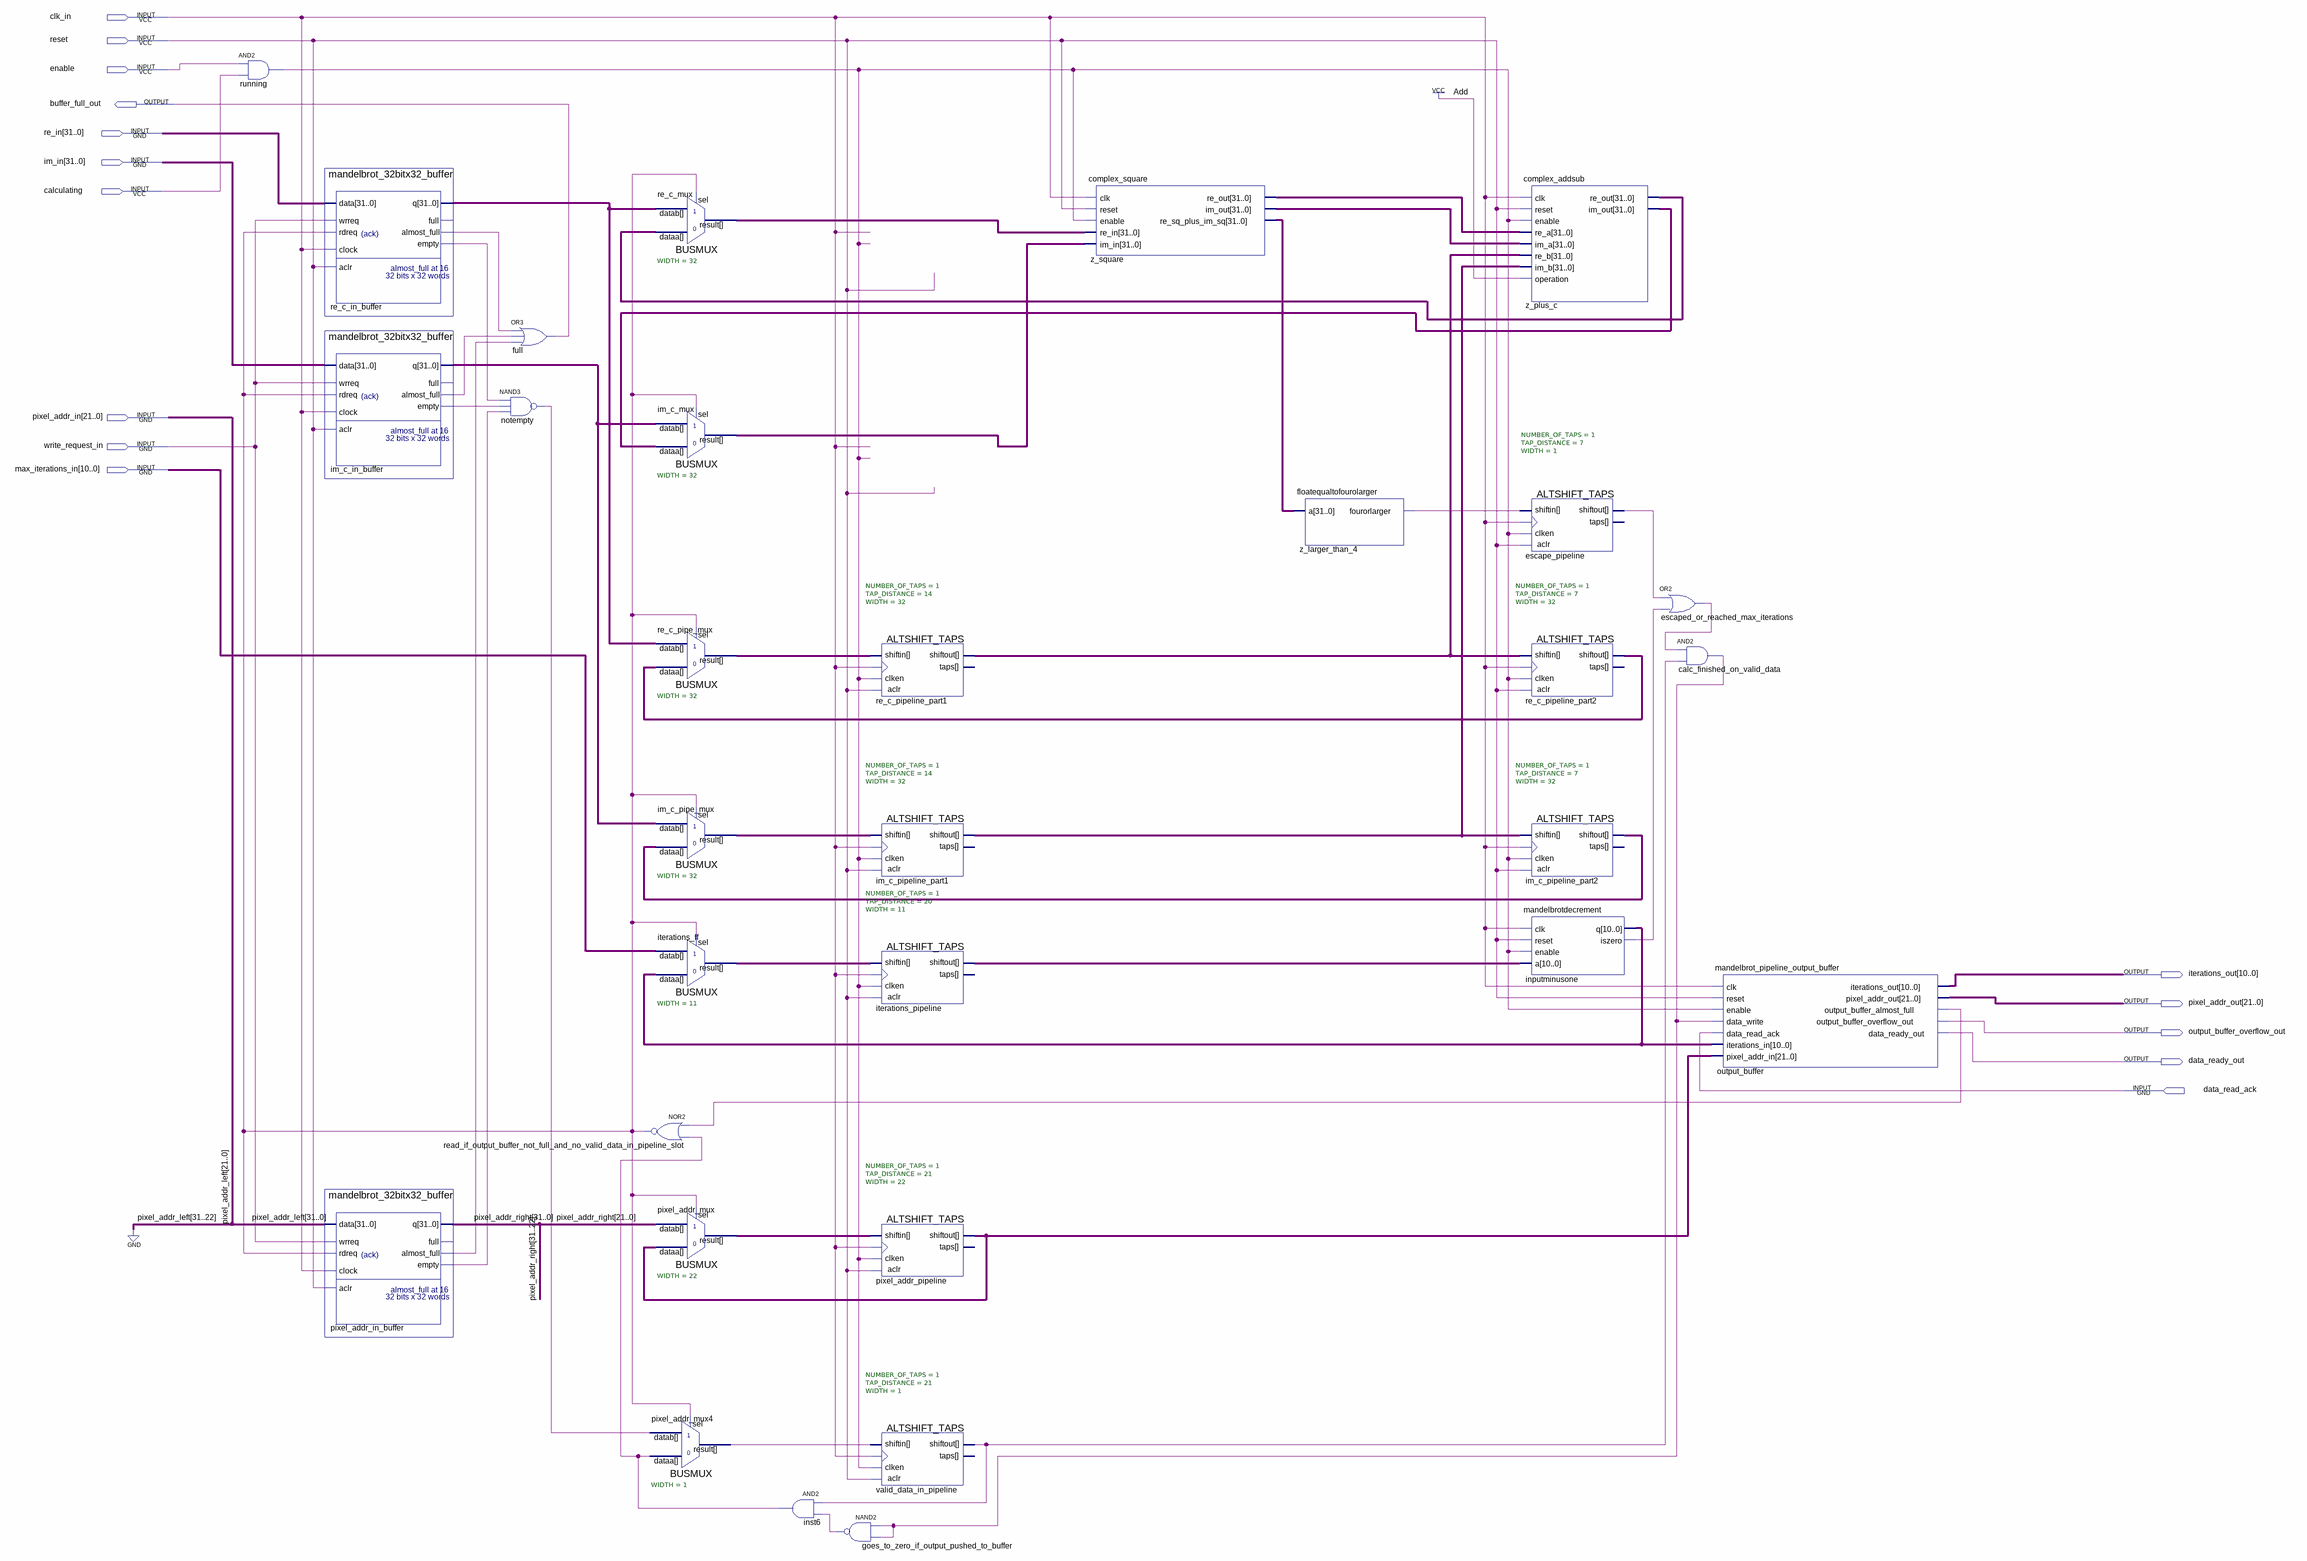
[diagram p0: schematic sheet]
// Quartus schematic mandelbrotpipeline.bdf as structural Verilog: 31 symbols, 15 pins
module mandelbrotpipeline (
  input  clk_in,
  input  reset,
  input  enable,
  input  [31:0] re_in,
  input  [31:0] im_in,
  input  calculating,
  input  [21:0] pixel_addr_in,
  input  write_request_in,
  input  [10:0] max_iterations_in,
  input  data_read_ack,
  output buffer_full_out,
  output [10:0] iterations_out,
  output [21:0] pixel_addr_out,
  output output_buffer_overflow_out,
  output data_ready_out
);

  wire calc_finished_on_valid_data_out, escape_pipeline_shiftout, escaped_or_reached_max_iterations_out,
       goes_to_zero_if_output_pushed_to_buffer_out, im_c_in_buffer_almost_full, im_c_in_buffer_empty,
       inputminusone_iszero, inst6_out, notempty_out, output_buffer_output_buffer_almost_full,
       pixel_addr_in_buffer_almost_full, pixel_addr_in_buffer_empty, pixel_addr_mux4_result,
       re_c_in_buffer_almost_full, re_c_in_buffer_empty,
       read_if_output_buffer_not_full_and_no_valid_data_in_pipeline_slot_out, running_out,
       valid_data_in_pipeline_shiftout, z_larger_than_4_fourorlarger;
  wire [10:0] inputminusone_q, iterations_ff_result, iterations_pipeline_shiftout;
  wire [21:0] pixel_addr_mux_result, pixel_addr_pipeline_shiftout;
  wire [31:0] im_c_in_buffer_q, im_c_mux_result, im_c_pipe_mux_result, im_c_pipeline_part1_shiftout,
       im_c_pipeline_part2_shiftout, pixel_addr_right, re_c_in_buffer_q, re_c_mux_result,
       re_c_pipe_mux_result, re_c_pipeline_part1_shiftout, re_c_pipeline_part2_shiftout, z_plus_c_im_out,
       z_plus_c_re_out, z_square_im_out, z_square_re_out, z_square_re_sq_plus_im_sq;

  and running (running_out, enable, calculating);
  mandelbrot_32bitx32_buffer re_c_in_buffer (
    .data(re_in), .wrreq(write_request_in),
    .rdreq(read_if_output_buffer_not_full_and_no_valid_data_in_pipeline_slot_out), .clock(clk_in),
    .aclr(reset), .q(re_c_in_buffer_q), .almost_full(re_c_in_buffer_almost_full), .empty(re_c_in_buffer_empty));  // open: full
  mandelbrot_32bitx32_buffer im_c_in_buffer (
    .data(im_in), .wrreq(write_request_in),
    .rdreq(read_if_output_buffer_not_full_and_no_valid_data_in_pipeline_slot_out), .clock(clk_in),
    .aclr(reset), .q(im_c_in_buffer_q), .almost_full(im_c_in_buffer_almost_full), .empty(im_c_in_buffer_empty));  // open: full
  mandelbrot_32bitx32_buffer pixel_addr_in_buffer (
    .data({{10{1'b0}}, pixel_addr_in}), .wrreq(write_request_in),
    .rdreq(read_if_output_buffer_not_full_and_no_valid_data_in_pipeline_slot_out), .clock(clk_in),
    .aclr(reset), .q(pixel_addr_right), .almost_full(pixel_addr_in_buffer_almost_full),
    .empty(pixel_addr_in_buffer_empty));  // open: full
  nand notempty (notempty_out, re_c_in_buffer_empty, im_c_in_buffer_empty, pixel_addr_in_buffer_empty);
  or full (buffer_full_out, re_c_in_buffer_almost_full, im_c_in_buffer_almost_full, pixel_addr_in_buffer_almost_full);
  BUSMUX #(.WIDTH(32)) re_c_mux (
    .datab(re_c_in_buffer_q), .sel(read_if_output_buffer_not_full_and_no_valid_data_in_pipeline_slot_out),
    .dataa(z_plus_c_re_out), .result(re_c_mux_result));
  BUSMUX #(.WIDTH(32)) im_c_mux (
    .datab(im_c_in_buffer_q), .sel(read_if_output_buffer_not_full_and_no_valid_data_in_pipeline_slot_out),
    .dataa(z_plus_c_im_out), .result(im_c_mux_result));
  BUSMUX #(.WIDTH(32)) re_c_pipe_mux (
    .datab(re_c_in_buffer_q), .sel(read_if_output_buffer_not_full_and_no_valid_data_in_pipeline_slot_out),
    .dataa(re_c_pipeline_part2_shiftout), .result(re_c_pipe_mux_result));
  BUSMUX #(.WIDTH(32)) im_c_pipe_mux (
    .datab(im_c_in_buffer_q), .sel(read_if_output_buffer_not_full_and_no_valid_data_in_pipeline_slot_out),
    .dataa(im_c_pipeline_part2_shiftout), .result(im_c_pipe_mux_result));
  BUSMUX #(.WIDTH(11)) iterations_ff (
    .datab(max_iterations_in), .sel(read_if_output_buffer_not_full_and_no_valid_data_in_pipeline_slot_out),
    .dataa(inputminusone_q), .result(iterations_ff_result));
  nor read_if_output_buffer_not_full_and_no_valid_data_in_pipeline_slot (read_if_output_buffer_not_full_and_no_valid_data_in_pipeline_slot_out, output_buffer_output_buffer_almost_full, inst6_out);
  BUSMUX #(.WIDTH(22)) pixel_addr_mux (
    .datab(pixel_addr_right[21:0]),
    .sel(read_if_output_buffer_not_full_and_no_valid_data_in_pipeline_slot_out),
    .dataa(pixel_addr_pipeline_shiftout), .result(pixel_addr_mux_result));
  BUSMUX #(.WIDTH(1)) pixel_addr_mux4 (
    .datab(notempty_out), .sel(read_if_output_buffer_not_full_and_no_valid_data_in_pipeline_slot_out),
    .dataa(inst6_out), .result(pixel_addr_mux4_result));
  and inst6 (inst6_out, valid_data_in_pipeline_shiftout, goes_to_zero_if_output_pushed_to_buffer_out);
  ALTSHIFT_TAPS #(.NUMBER_OF_TAPS(1), .TAP_DISTANCE(14), .WIDTH(32)) re_c_pipeline_part1 (
    .shiftin(re_c_pipe_mux_result), .clken(running_out), .clock(clk_in), .aclr(reset),
    .shiftout(re_c_pipeline_part1_shiftout));  // open: taps
  ALTSHIFT_TAPS #(.NUMBER_OF_TAPS(1), .TAP_DISTANCE(14), .WIDTH(32)) im_c_pipeline_part1 (
    .shiftin(im_c_pipe_mux_result), .clken(running_out), .clock(clk_in), .aclr(reset),
    .shiftout(im_c_pipeline_part1_shiftout));  // open: taps
  ALTSHIFT_TAPS #(.NUMBER_OF_TAPS(1), .TAP_DISTANCE(20), .WIDTH(11)) iterations_pipeline (
    .shiftin(iterations_ff_result), .clken(running_out), .clock(clk_in), .aclr(reset),
    .shiftout(iterations_pipeline_shiftout));  // open: taps
  ALTSHIFT_TAPS #(.NUMBER_OF_TAPS(1), .TAP_DISTANCE(21), .WIDTH(22)) pixel_addr_pipeline (
    .shiftin(pixel_addr_mux_result), .clken(running_out), .clock(clk_in), .aclr(reset),
    .shiftout(pixel_addr_pipeline_shiftout));  // open: taps
  ALTSHIFT_TAPS #(.NUMBER_OF_TAPS(1), .TAP_DISTANCE(21), .WIDTH(1)) valid_data_in_pipeline (
    .shiftin(pixel_addr_mux4_result), .clken(running_out), .clock(clk_in), .aclr(reset),
    .shiftout(valid_data_in_pipeline_shiftout));  // open: taps
  nand goes_to_zero_if_output_pushed_to_buffer (goes_to_zero_if_output_pushed_to_buffer_out, calc_finished_on_valid_data_out, calc_finished_on_valid_data_out);
  complex_square z_square (
    .clk(clk_in), .reset(reset), .enable(running_out), .re_in(re_c_mux_result), .im_in(im_c_mux_result),
    .re_out(z_square_re_out), .im_out(z_square_im_out), .re_sq_plus_im_sq(z_square_re_sq_plus_im_sq));
  floatequaltofourolarger z_larger_than_4 (.a(z_square_re_sq_plus_im_sq), .fourorlarger(z_larger_than_4_fourorlarger));
  complex_addsub z_plus_c (
    .clk(clk_in), .reset(reset), .enable(running_out), .re_a(z_square_re_out), .im_a(z_square_im_out),
    .re_b(re_c_pipeline_part1_shiftout), .im_b(im_c_pipeline_part1_shiftout), .operation(1'b1),
    .re_out(z_plus_c_re_out), .im_out(z_plus_c_im_out));
  ALTSHIFT_TAPS #(.NUMBER_OF_TAPS(1), .TAP_DISTANCE(7), .WIDTH(1)) escape_pipeline (
    .shiftin(z_larger_than_4_fourorlarger), .clken(running_out), .clock(clk_in), .aclr(reset),
    .shiftout(escape_pipeline_shiftout));  // open: taps
  ALTSHIFT_TAPS #(.NUMBER_OF_TAPS(1), .TAP_DISTANCE(7), .WIDTH(32)) re_c_pipeline_part2 (
    .shiftin(re_c_pipeline_part1_shiftout), .clken(running_out), .clock(clk_in), .aclr(reset),
    .shiftout(re_c_pipeline_part2_shiftout));  // open: taps
  ALTSHIFT_TAPS #(.NUMBER_OF_TAPS(1), .TAP_DISTANCE(7), .WIDTH(32)) im_c_pipeline_part2 (
    .shiftin(im_c_pipeline_part1_shiftout), .clken(running_out), .clock(clk_in), .aclr(reset),
    .shiftout(im_c_pipeline_part2_shiftout));  // open: taps
  mandelbrotdecrement inputminusone (
    .clk(clk_in), .reset(reset), .enable(running_out), .a(iterations_pipeline_shiftout), .q(inputminusone_q),
    .iszero(inputminusone_iszero));
  or escaped_or_reached_max_iterations (escaped_or_reached_max_iterations_out, escape_pipeline_shiftout, inputminusone_iszero);
  and calc_finished_on_valid_data (calc_finished_on_valid_data_out, escaped_or_reached_max_iterations_out, valid_data_in_pipeline_shiftout);
  mandelbrot_pipeline_output_buffer output_buffer (
    .clk(clk_in), .reset(reset), .enable(running_out), .data_write(calc_finished_on_valid_data_out),
    .data_read_ack(data_read_ack), .iterations_in(inputminusone_q),
    .pixel_addr_in(pixel_addr_pipeline_shiftout), .iterations_out(iterations_out),
    .pixel_addr_out(pixel_addr_out), .output_buffer_almost_full(output_buffer_output_buffer_almost_full),
    .output_buffer_overflow_out(output_buffer_overflow_out), .data_ready_out(data_ready_out));

  // Other names for the same wires on the sheet: pixel_addr_left[21:0] = pixel_addr_in
endmodule
